# EAGLE design GateCVBooster (EAGLE 7.7.0)
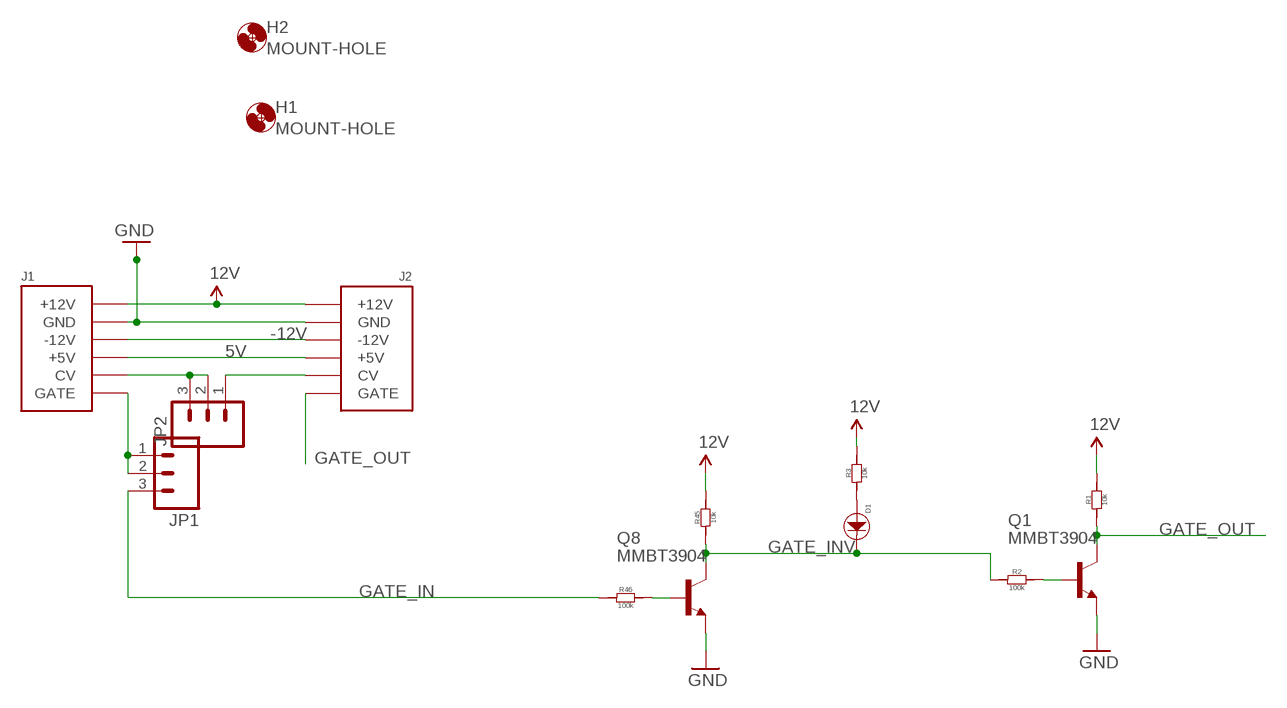
[diagram p0: schematic, sheet 1]

## Parts
D1  LED  [LED0603]
H1  MOUNT-HOLE  [3.2-NOMARKINGS-SMALLSAFEZONE]
H2  MOUNT-HOLE  [3.2-NOMARKINGS-SMALLSAFEZONE]
J1  POWERSHROUDED  [POWER_16_SHROUDED]
J2  POWER_SHROUDED_NOTEXT  [POWER_16_SHROUDED_NOTEXT]
JP1  M03PTH  [1X03]
JP2  M03PTH  [1X03]
Q1  MMBT3904  MMBT3904LT1-NPN-SOT23-BEC  [SOT23-BEC]
Q8  MMBT3904  MMBT3904LT1-NPN-SOT23-BEC  [SOT23-BEC]
R1  10k  R-0603  [R0603]
R2  100k  R-0603  [R0603]
R3  10k  R-0603  [R0603]
R45  10k  R-0603  [R0603]
R46  100k  R-0603  [R0603]

## Nets
5V [heavypower]: J1.11(+5V) J1.12(+5V) J2.11(+5V) J2.12(+5V)
12V [heavypower]: J1.9(+12V) J1.10(+12V) J2.9(+12V) J2.10(+12V) R1.2 R3.2 R45.2
-12V [heavypower]: J1.1(-12V) J1.2(-12V) J2.1(-12V) J2.2(-12V)
GATE_IN: JP1.3 R46.1
GATE_INV: D1.- Q8.C R2.1 R45.1
GATE_OUT: J2.15(GATE) J2.16(GATE) Q1.C R1.1
GND [groundplane]: J1.3(GND) J1.4(GND) J1.5(GND) J1.6(GND) J1.7(GND) J1.8(GND) J2.3(GND) J2.4(GND) J2.5(GND) J2.6(GND) J2.7(GND) J2.8(GND) Q1.E Q8.E
N$1: J1.15(GATE) J1.16(GATE) JP1.1 JP1.2
N$2: J1.13(CV) J1.14(CV) JP2.2 JP2.3
N$3: D1.+ R3.1
N$5: J2.13(CV) J2.14(CV) JP2.1
N$7: Q1.B R2.2
N$71: Q8.B R46.2

## Library data of the parts
D1 = EurorackModularParts:LED*: LED
H1 H2 = zephod-components:MOUNT-HOLE: MOUNTING HOLE with drill center marker
J1 J2 = EurorackModularParts:POWER
JP1 JP2 = SparkFun-Connectors:M03: Header 3 Standard 3-pin 0.1" header. Use with straight break away headers (SKU : PRT-00116), right angle break away headers (PRT-00553), swiss pins (PRT-00743), machine pins (PRT-00117), and female headers (PRT-00115). Molex polarized connector foot print use with SKU : PRT-08232 with associated crimp pins and housings.
Q1 Q8 = transistor:*-NPN-: NPN Transistror BF959 corrected 2008.03.06; MF: NXP; MPN: PMBT3904,215; OC_FARNELL: 2336795
R1-R3 R45 R46 = OPL:R*; OC_FARNELL: unknown

## Net classes
0 default: width 0.305 mm, clearance 0.178 mm
1 heavypower: width 0.381 mm
2 mediumpower: width 0.254 mm
3 groundplane: width 0.203 mm, clearance 0.178 mm

## Board
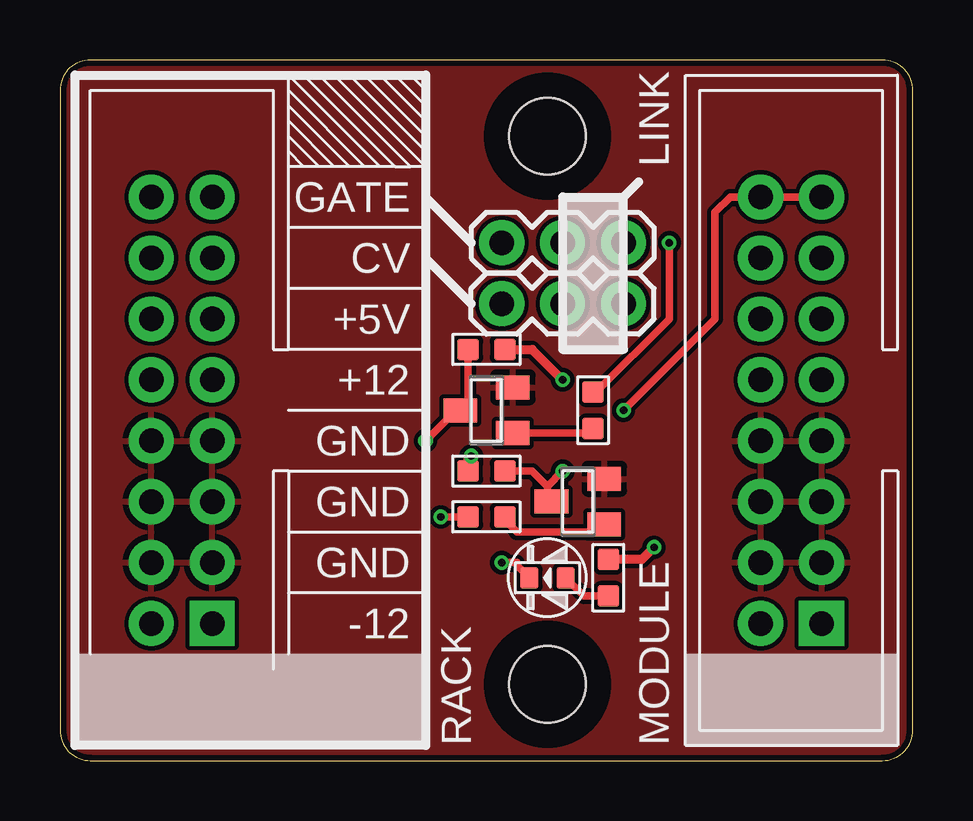
[diagram p1: board, top side]
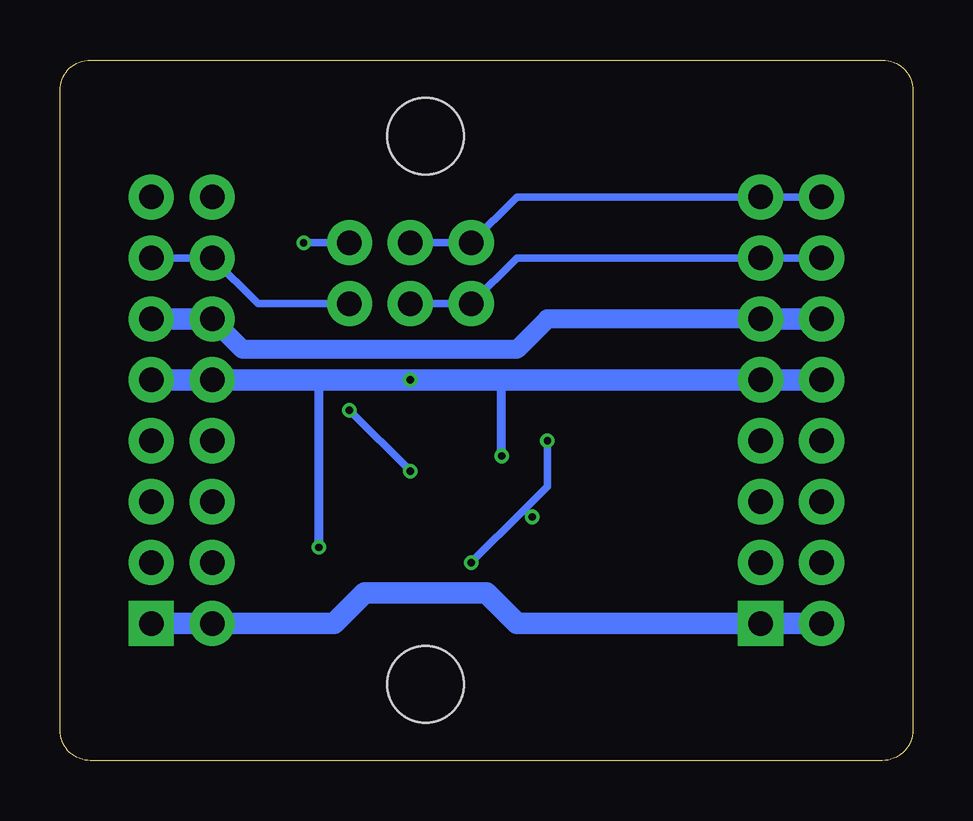
[diagram p2: board, bottom side, seen from below]

Size 35.56 x 29.21 mm. Coordinates in mm from the lower left corner, seen from the top.
Outline: 0,27.94 0,1.27 arc90 1.27,0 34.29,0 arc90 35.56,1.27 35.56,27.94 arc90 34.29,29.21 1.27,29.21 arc90 0,27.94
Copper layers (1*16): Top 0.035mm / dielectric 1.5mm / Bottom 0.035mm
Design rules "ITEADstudio_DRC": minimum track width 6mil, minimum drill 12mil, track to track 6mil, track to pad 6mil, pad to pad 6mil, via to via 6mil, smd to smd 0mil, copper to edge 10mil, drill to drill 10mil, minimum pad ring 10mil, minimum via ring 6mil, stop-mask expansion 2mil, vias tented up to drill 100mil, thermal gap 10mil

### Footprints (pad centres in the part's own frame; a part is rotated, then mirrored left to right if it is on the bottom)
LED0603 = smd 0.762 x 0.889: + -0.762,0; - 0.762,0
3.2-NOMARKINGS-SMALLSAFEZONE = hole 3.2: 0,0
POWER_16_SHROUDED = drill 1.016 pad 1.88 square: 1 -8.89,-1.27 | drill 1.016 pad 1.88: 2 -8.89,1.27; 3 -6.35,-1.27; 4 -6.35,1.27; 5 -3.81,-1.27; 6 -3.81,1.27; 7 -1.27,-1.27; 8 -1.27,1.27; 9 1.27,-1.27; 10 1.27,1.27; 11 3.81,-1.27; 12 3.81,1.27; 13 6.35,-1.27; 14 6.35,1.27; 15 8.89,-1.27; 16 8.89,1.27
POWER_16_SHROUDED_NOTEXT = drill 1.016 pad 1.88 square: 1 -8.89,-1.27 | drill 1.016 pad 1.88: 2 -8.89,1.27; 3 -6.35,-1.27; 4 -6.35,1.27; 5 -3.81,-1.27; 6 -3.81,1.27; 7 -1.27,-1.27; 8 -1.27,1.27; 9 1.27,-1.27; 10 1.27,1.27; 11 3.81,-1.27; 12 3.81,1.27; 13 6.35,-1.27; 14 6.35,1.27; 15 8.89,-1.27; 16 8.89,1.27
1X03 = drill 1.016 pad 1.88: 1 0,0; 2 2.54,0; 3 5.08,0
SOT23-BEC = smd 1 x 1.4: B -0.95,-1.1; C 0,1.1; E 0.95,-1.1
R0603 = smd 0.889 x 0.889: 1 -0.762,0; 2 0.762,0

### Placement (x,y rotation side)
D1  20.32,7.62 180 top
H1  20.32,26.04 0 top
H2  20.32,3.17 0 top
J1  5.08,14.61 90 top
J2  30.48,14.61 90 top
JP1  18.41,21.59 0 top
JP2  23.5,19.05 180 top
Q1  21.59,10.79 90 top
Q8  17.78,14.61 90 top
R1  17.78,12.06 180 top
R2  17.78,10.16 0 top
R3  22.86,7.62 90 top
R45  17.78,17.15 0 top
R46  22.23,14.61 270 top

### Tracks (layer width: path | path; a pad name or v marks a point on that pad's centre or on a via)
5V
  Bottom 0.8: J1.11 15.24,18.42 16.51,17.15 27.94,17.15 J2.12
  Bottom 0.9: J1.12 J1.11 | J2.12 J2.11
12V  (via drill 0.3)
  Top 0.381: R1.2 17.02,12.57 v17.14,12.7 | R45.2 19.68,17.15 v20.95,15.88 | v24.77,8.89 24.26,8.38 R3.2
  Bottom 0.381: v17.14,12.7 17.14,15.88 | v24.77,8.89 24.77,15.88
  Bottom 0.9: J1.10 J1.9 17.14,15.88 v20.95,15.88 24.77,15.88 J2.10 J2.9
-12V
  Bottom 0.9: J1.2 J1.1 16.51,5.71 17.78,6.98 22.86,6.98 24.13,5.71 J2.2 J2.1
GATE_IN  (via drill 0.3)
  Top 0.305: R46.1 22.35,15.37 25.4,18.42 v25.4,21.59
  Bottom 0.305: v25.4,21.59 JP1.3
GATE_INV  (via drill 0.3)
  Top 0.305: R45.1 17.02,14.94 Q8.C 16.51,14.61 v15.24,13.33 | v18.41,8.26 19.05,8.26 19.05,8.13 D1.- | R2.1 v15.88,10.16
  Bottom 0.305: v15.24,13.33 15.24,11.43 16.19,10.48 | 16.19,10.48 v18.41,8.26 | v15.88,10.16 16.19,10.48
GATE_OUT  (via drill 0.3)
  Top 0.305: R1.1 19.68,12.06 20.32,11.43 | 20.32,11.43 20.32,10.96 Q1.C | J2.15 J2.16 27.94,23.5 27.3,22.86 27.3,18.42 v23.5,14.61 | v20.95,12.06 20.32,11.43
  Bottom 0.305: v23.5,14.61 v20.95,12.06
GND
  pour Top: 34.29,0 1.27,0 arc-90 0,1.27 0,27.94 arc-90 1.27,29.21 34.29,29.21 arc-90 35.56,27.94 35.56,1.27 arc-90
N$1
  Bottom 0.305: J1.16 J1.15 16.51,23.5 JP1.1 JP1.2
N$2
  Bottom 0.305: JP2.2 JP2.3 16.51,20.96 J1.13 J1.14
N$3
  Top 0.305: D1.+ 21.84,6.86 R3.1
N$5
  Bottom 0.305: J2.13 J2.14 27.3,19.05 JP2.1
N$7
  Top 0.305: R2.2 18.41,10.16 19.05,9.53 22.37,9.53 Q1.B
N$71
  Top 0.305: Q8.B 22.04,13.65 R46.2

### Text on the board
tPlace: LINK | RACK | MODULE